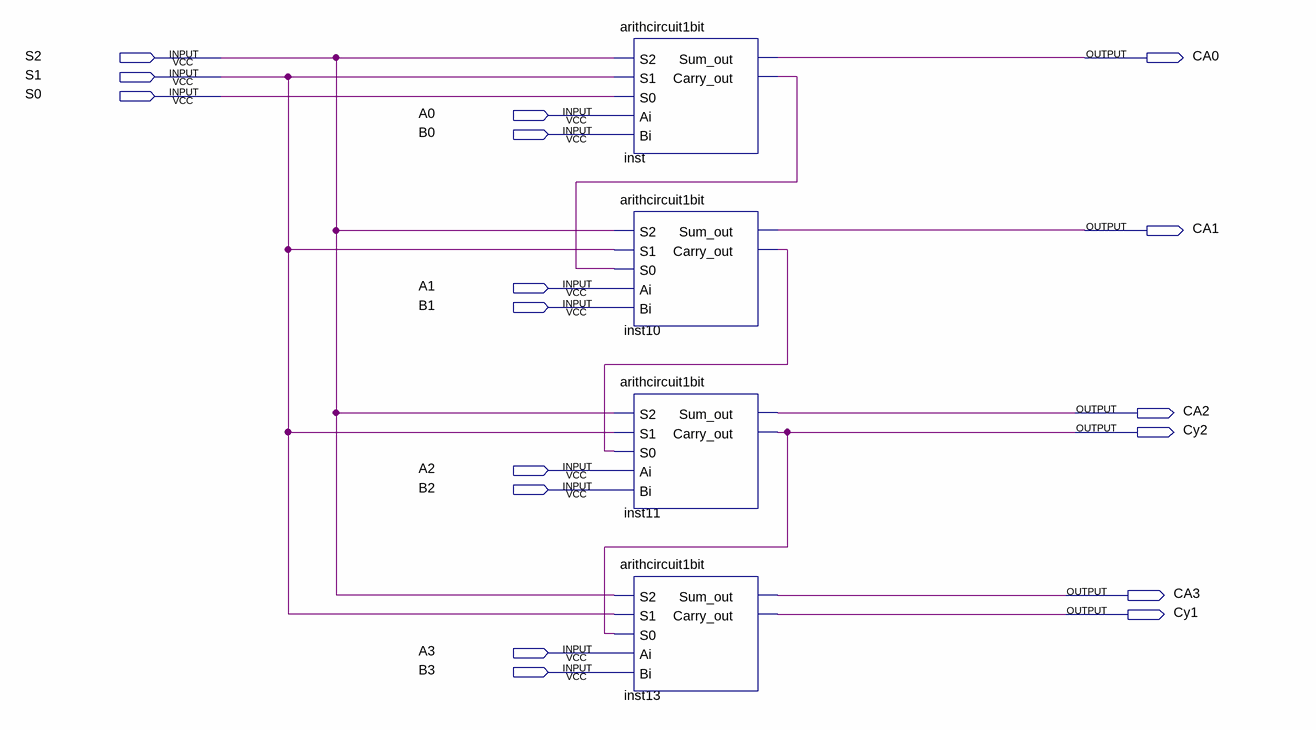
[diagram p0: schematic sheet]
// Quartus schematic arithcircuit4bits.bdf as structural Verilog: 4 symbols, 17 pins
module arithcircuit4bits (
  input  S2,
  input  S1,
  input  S0,
  input  A0,
  input  B0,
  input  A1,
  input  B1,
  input  A2,
  input  B2,
  input  A3,
  input  B3,
  output CA0,
  output CA1,
  output CA2,
  output Cy2,
  output CA3,
  output Cy1
);

  wire inst10_carry_out, inst_carry_out;

  arithcircuit1bit inst (.S2(S2), .S1(S1), .S0(S0), .Ai(A0), .Bi(B0), .Sum_out(CA0), .Carry_out(inst_carry_out));
  arithcircuit1bit inst10 (
    .S2(S2), .S1(S1), .S0(inst_carry_out), .Ai(A1), .Bi(B1), .Sum_out(CA1), .Carry_out(inst10_carry_out));
  arithcircuit1bit inst11 (.S2(S2), .S1(S1), .S0(inst10_carry_out), .Ai(A2), .Bi(B2), .Sum_out(CA2), .Carry_out(Cy2));
  arithcircuit1bit inst13 (.S2(S2), .S1(S1), .S0(Cy2), .Ai(A3), .Bi(B3), .Sum_out(CA3), .Carry_out(Cy1));
endmodule
